# Altium project RFtest.PrjPCB
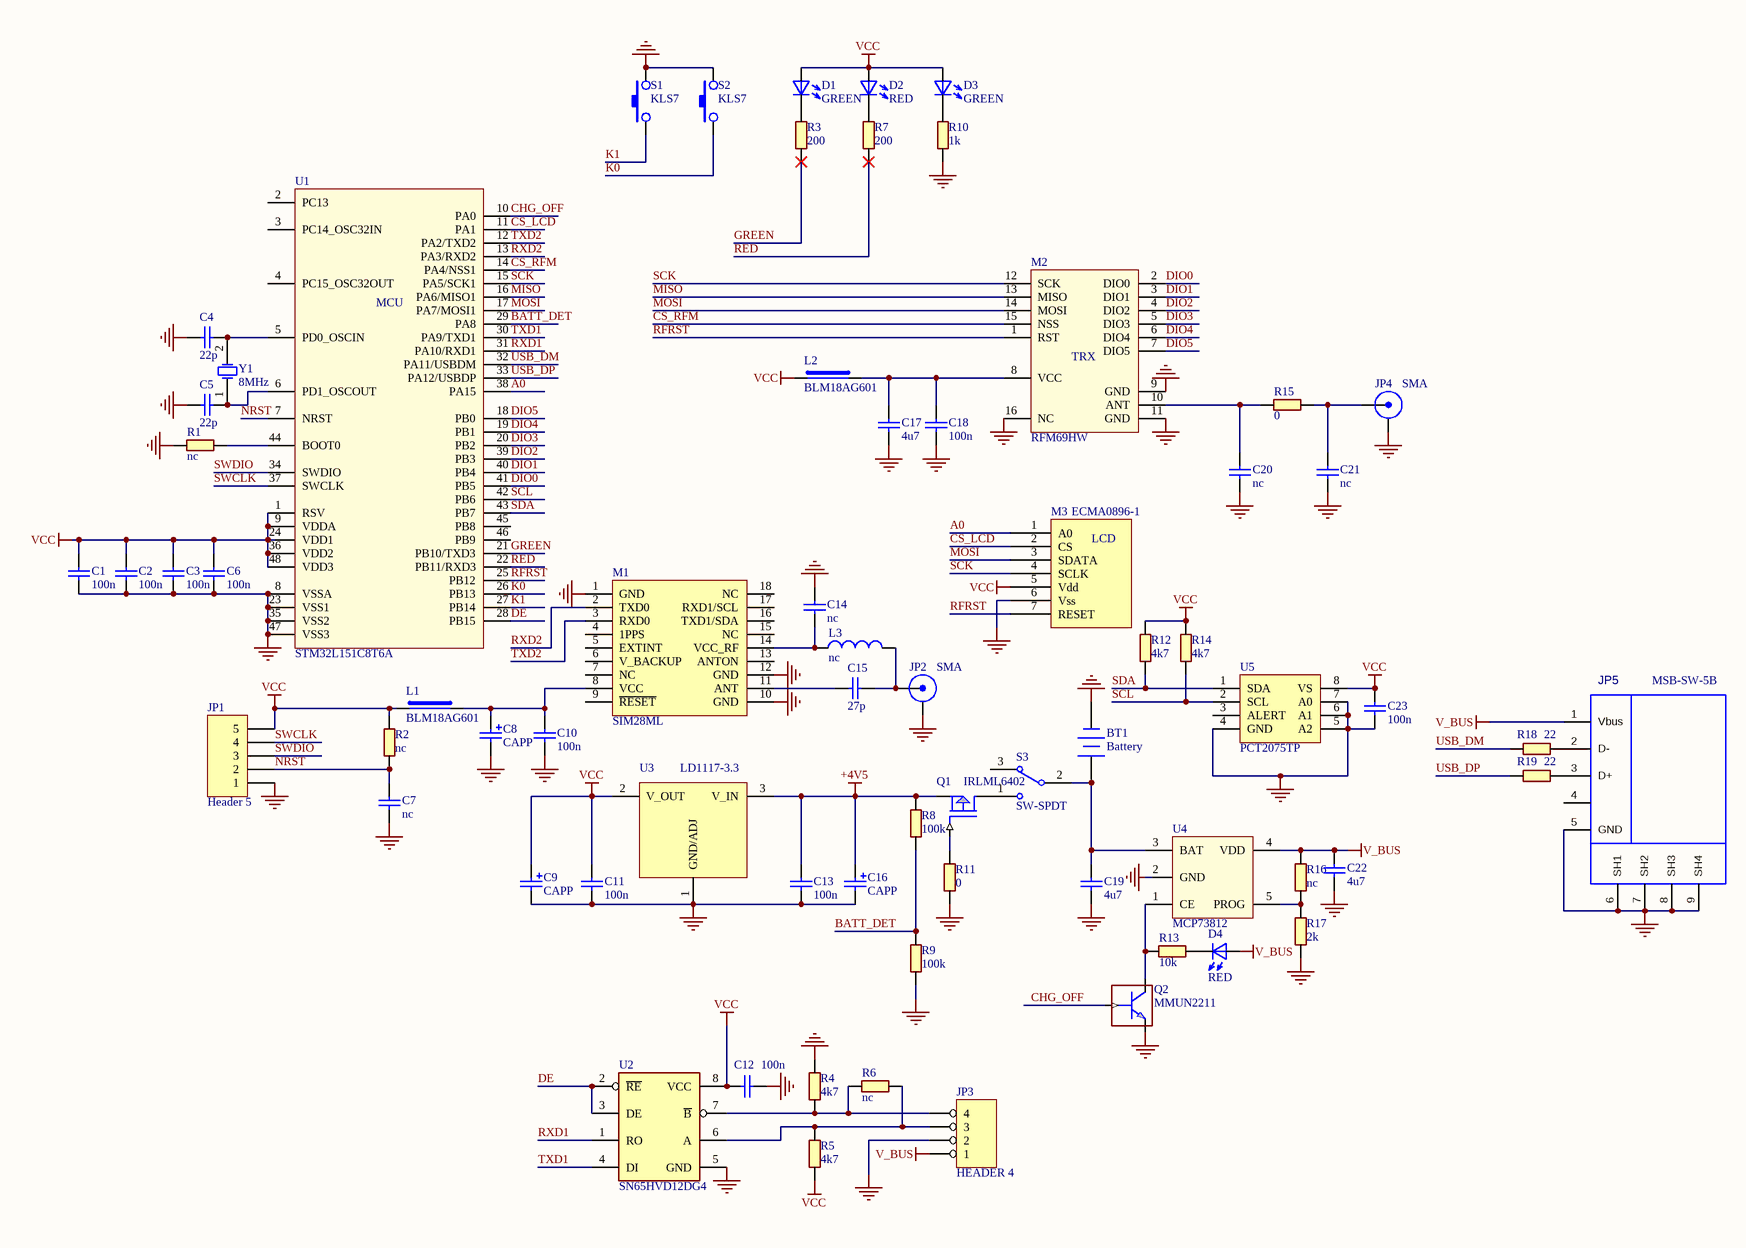
[diagram p0: RFM232_V08_USB.SchDoc]
1 sheet, 69 parts. Net scope: global (net labels, ports and power ports of the same name join across sheets).
Board file: RFM232_V08_USB.PcbDoc

## Sheet RFM232_V08_USB.SchDoc
size 420 x 297 mm; Scale: {Масш.}; Title1str: {Наименование}; PageSetup: Record=PageOptions|CenterHorizontal=False|CenterVertical=False|PrintScale=0.95|XCorrection=0.00|YCorrection=0.00|PrintKind=1|BorderSize=5000000|LeftOffset=0|BottomOffset=0|Orientation=1|PaperLength=1000|PaperWidth=1000|Scale=100|PaperSource=15|PrintQuality=600|MediaType=1|DitherType=10|PaperKind=A4|PrintScaleMode=1; Title2str: {Наименование}; ProcessInspection: {Т.контр.}; Mass: {Масса}; NormInspection: {Н.контр.}; EngineerName: {Инженер}; Letter1Column: {}; Letter2Column: {}; Letter3Column: {}; DocumentType: {Документ}; DocumentType1str: {Документ}; DocumentType2str: {Документ}

### Parts
BT1  Battery  [18650]
C1  100n  [C-0603]
C2  100n  [C-0603]
C3  100n  [C-0603]
C4  22p  [C-0603]
C5  22p  [C-0603]
C6  100n  [C-0603]
C7  nc  [C-0603]
C8  CAPP  [C-TANTAL-B]
C9  CAPP  [C-TANTAL-B]
C10  100n  [C-0603]
C11  100n  [C-0603]
C12  100n  [C-0603]
C13  100n  [C-0603]
C14  nc  [C-0603]
C15  27p  [C-0603]
C16  CAPP  [C-TANTAL-B]
C17  4u7  [C-0805]
C18  100n  [C-0603]
C19  4u7  [C-0805]
C20  nc  [C-0603]
C21  nc  [C-0603]
C22  4u7  [C-0805]
C23  100n  [C-0603]
D1  GREEN  [LED_0805]
D2  RED  [LED_0805]
D3  GREEN  [LED_0805]
D4  RED  [LED_0805]
JP1  Header 5  [PLS1-5R]
JP2  SMA  [AMPHENOL_132357-11]
JP3  HEADER 4  [PLS1-4]
JP4  SMA  [AMPHENOL_132357-11]
JP5  MSB-SW-5B  [CU09SAM]
L1  BLM18AG601  [L-0603]
L2  BLM18AG601  [L-0603]
L3  nc  [L-0603]
M1  SIM28ML  [LGA18_GNSS]
M2  RFM69HW  [LGA16_RFM69]
M3  ECMA0896-1  [PLS1-7]
Q1  IRLML6402  [SOT-23]
Q2  MMUN2211  [SOT-23]
R1  nc  [R-0603]
R2  nc  [R-0603]
R3  200  [R-0603]
R4  4k7  [R-0603]
R5  4k7  [R-0603]
R6  nc  [R-0603]
R7  200  [R-0603]
R8  100k  [R-0603]
R9  100k  [R-0603]
R10  1k  [R-0603]
R11  0  [R-0603]
R12  4k7  [R-0603]
R13  10k  [R-0603]
R14  4k7  [R-0603]
R15  0  [R-0603]
R16  nc  [R-0603]
R17  2k  [R-0603]
R18  22  [R-0603]
R19  22  [R-0603]
S1  KLS7  [KLS7-TS3602]
S2  KLS7  [KLS7-TS3602]
S3  SW-SPDT  [SPDT_100mil]
U1  STM32L151C8T6A  [LQFP-48]
U2  SN65HVD12DG4  [SO8]
U3  LD1117-3.3  [SOT230P700X180-4N]
U4  MCP73812  [SOT-23-5]
U5  PCT2075TP  [SOT1069-2]
Y1  8MHz  [HC49_3.5mm]

### Nets
+4V5: C13.1 C16.2 Q1.2(SOURCE) R8.2 U3.3(V_IN)
GND: BT1.2(-) C1.2 C2.2 C3.2 C4.1 C5.1 C6.2 C7.2 C8.1 C9.1 C10.2 C11.2 C12.2 C13.2 C14.1 C16.1 C17.2 C18.2 C19.2 C20.2 C21.2 C22.2 C23.2 JP1.1 JP2.2(Y) JP3.2 JP4.2(Y) JP5.5(GND) JP5.6(SH1) JP5.7(SH2) JP5.8(SH3) JP5.9(SH4) M1.1(GND) M1.10(GND) M1.12(GND) M2.9(GND) M2.11(GND) M2.16(NC) M3.6(Vss) Q2.2(EMITTER) R1.1 R4.2 R9.1 R10.2 R11.1 R17.1 S1.2 S2.2 U1.8(VSSA) U1.23(VSS1) U1.35(VSS2) U1.47(VSS3) U2.5(GND) U3.1(GND/ADJ) U4.2(GND) U5.4(GND) U5.5(A2) U5.6(A1) U5.7(A0)
V_BUS: C22.1 D4.A JP3.1 JP5.1(Vbus) R16.2 U4.4(VDD)
VCC: C1.1 C2.1 C3.1 C6.1 C9.2 C11.1 C12.1 C23.1 D1.A D2.A D3.A JP1.5 L1.1 L2.1 M3.5(Vdd) R2.2 R5.1 R12.2 R14.2 U1.1(RSV) U1.9(VDDA) U1.24(VDD1) U1.36(VDD2) U1.48(VDD3) U2.8(VCC) U3.2(V_OUT) U5.8(VS)
A0: M3.1(A0) U1.38(PA15)
BATT_DET: R8.1 R9.2 U1.29(PA8)
CHG_OFF: Q2.1(BASE) U1.10(PA0)
CS_LCD: M3.2(CS) U1.11(PA1)
CS_RFM: M2.15(NSS) U1.14(PA4/NSS1)
DE: U1.28(PB15) U2.2(~{RE}) U2.3(DE)
DIO0: M2.2(DIO0) U1.41(PB5)
DIO1: M2.3(DIO1) U1.40(PB4)
DIO2: M2.4(DIO2) U1.39(PB3)
DIO3: M2.5(DIO3) U1.20(PB2)
DIO4: M2.6(DIO4) U1.19(PB1)
DIO5: M2.7(DIO5) U1.18(PB0)
GREEN: R3.2 U1.21(PB10/TXD3)
K0: S2.1 U1.26(PB13)
K1: S1.1 U1.27(PB14)
MISO: M2.13(MISO) U1.16(PA6/MISO1)
MOSI: M2.14(MOSI) M3.3(SDATA) U1.17(PA7/MOSI1)
NRST: C7.1 JP1.2 R2.1 U1.7(NRST)
RED: R7.2 U1.22(PB11/RXD3)
RFRST: M2.1(RST) M3.7(RESET) U1.25(PB12)
RXD1: U1.31(PA10/RXD1) U2.1(RO)
RXD2: M1.2(TXD0) U1.13(PA3/RXD2)
SCK: M2.12(SCK) M3.4(SCLK) U1.15(PA5/SCK1)
SCL: R14.1 U1.42(PB6) U5.2(SCL)
SDA: R12.1 U1.43(PB7) U5.1(SDA)
SWCLK: JP1.4 U1.37(SWCLK)
SWDIO: JP1.3 U1.34(SWDIO)
TXD1: U1.30(PA9/TXD1) U2.4(DI)
TXD2: M1.3(RXD0) U1.12(PA2/TXD2)
USB_DM: R18.2 U1.32(PA11/USBDM)
USB_DP: R19.2 U1.33(PA12/USBDP)
NetBT1_1: BT1.1(+) C19.1 S3.2 U4.3(BAT)
NetC4_2: C4.2 U1.5(PD0_OSCIN) Y1.2(OSC2)
NetC5_2: C5.2 U1.6(PD1_OSCOUT) Y1.1(OSC1)
NetC8_2: C8.2 C10.1 L1.2 M1.8(VCC)
NetC14_2: C14.2 L3.1 M1.14(VCC_RF)
NetC15_1: C15.1 M1.11(ANT)
NetC15_2: C15.2 JP2.1(X) L3.2
NetC17_1: C17.1 C18.1 L2.2 M2.8(VCC)
NetC20_1: C20.1 M2.10(ANT) R15.1
NetC21_1: C21.1 JP4.1(X) R15.2
NetD1_K: D1.K R3.1
NetD2_K: D2.K R7.1
NetD3_K: D3.K R10.1
NetD4_K: D4.K R13.1
NetJP3_3: JP3.3 R5.2 R6.1 U2.6(A)
NetJP3_4: JP3.4 R4.1 R6.2 U2.7(~{B})
NetJP5_2: JP5.2(D-) R18.1
NetJP5_3: JP5.3(D+) R19.1
NetQ1_1: Q1.1(GATE) R11.2
NetQ1_3: Q1.3(DRAIN) S3.1
NetQ2_3: Q2.3(COLLECTOR) R13.2 U4.1(CE)
NetR1_2: R1.2 U1.44(BOOT0)
NetR16_1: R16.1 R17.2 U4.5(PROG)

Not connected (* = marked no-connect by the designer): JP5 4; M1 4(1PPS) 5(EXTINT) 6(V_BACKUP) 7(NC) 9(~{RESET}) 13(ANTON) 15(NC) 16(TXD1/SDA) 17(RXD1/SCL) 18(NC); S3 3; U1 2(PC13) 3(PC14_OSC32IN) 4(PC15_OSC32OUT) 45(PB8) 46(PB9); U5 3(ALERT)

### Notes on the sheet
- Перв. примен.
- Справ. №
- Подп. и дата
- Инв. № дубл.
- Взам. инв. №
- Изм.
- Лист
- № докум.
- Подп.
- Дата
- Лит.
- Масса
- Масштаб
- Т.контр.
- Пров.
- Разраб.
- Листов
- Инв. № подл.
- Н.контр.
- Утв.
- Копировал
- Формат А3
- (in symbol ECMA0896) LCD
- (in symbol RFM69HW_V13_2) TRX
- (in symbol STM32L151C8T6) MCU

### Library data of the parts
BT1 = Battery: Multicell Battery; Published: 24-Mar-1999; LatestRevisionDate: 17-Jul-2002; LatestRevisionNote: Re-released for DXP Platform.; PackageReference: BAT-2; Publisher: Altium Limited; PackageDescription: Battery; 2 Leads
C1-C7 C10-C15 C17-C23 = CAPN
D1-D4 = DLED
JP1 = Header 5: Header, 5-Pin; LatestRevisionDate: 17-Jul-2002; LatestRevisionNote: Re-released for DXP Platform.; Publisher: Altium Limited
JP2 JP4 = X-004: RF Connector; Производитель: *; Допустимая замена: *; Цена: *; PDF файл: *; Температурный диапазон: *; Описание пользователя: *; Конфигурация контактов RxNN: *; *: *
JP3 = HEADER 4: 4 Pin Header; Производитель: *; Допустимая замена: *; Цена: *; PDF файл: *; Температурный диапазон: *; Описание пользователя: *; Конфигурация контактов RxNN: *; *: *
L1 L2 = SUPRESOR: Примечание: *; Производитель: *
L3 = L
M2 = RFM69HW_V13_2
M3 = ECMA0896
R1-R19 = RES
S1 S2 = SW-1: Вид: Кнопка; Производитель: *; Описание пользователя: *; *: *; Корпус: =Footprint; Тип: KLS7
S3 = SW-SPDT: SPDT Subminiature Toggle Switch, Right Angle Mounting, Vertical Actuation; Published: 24-Mar-1999; LatestRevisionDate: 17-Dec-2003; LatestRevisionNote: Schematic revised, PCB Footprint replaced.; DatasheetVersion: 05-Dec-2000; PackageReference: TL36WW15050; Publisher: Altium Limited; PackageDescription: Switch; 4 Leads; ComponentLink1Description: Manufacturer Link; ComponentLink1URL: http://www.apem.com
U1 = STM32L151C8T6
U3 = LM1117_3.3: Вид: Мікросхема; Тип: LD1117-3.3; Корпус: =Footprint
U5 = TMP75: Part Field 1: NXP; Part Field 6: I2C Digital temperature sensor
Y1 = XTAL: Crystal Oscillator; Published: 8-Jun-2000; LatestRevisionDate: 17-Jul-2002; LatestRevisionNote: Re-released for DXP Platform.; PackageReference: R38; Publisher: Altium Limited; PackageDescription: Crystal, Thru-Hole; 2 Leads; Body 3.1 x 8.2 mm (Dia.xH)
JP5 = MSB-SW-5B: Value: MSB-SW-5B